# EAGLE schematic cookie-mouse (EAGLE 6.6.0)
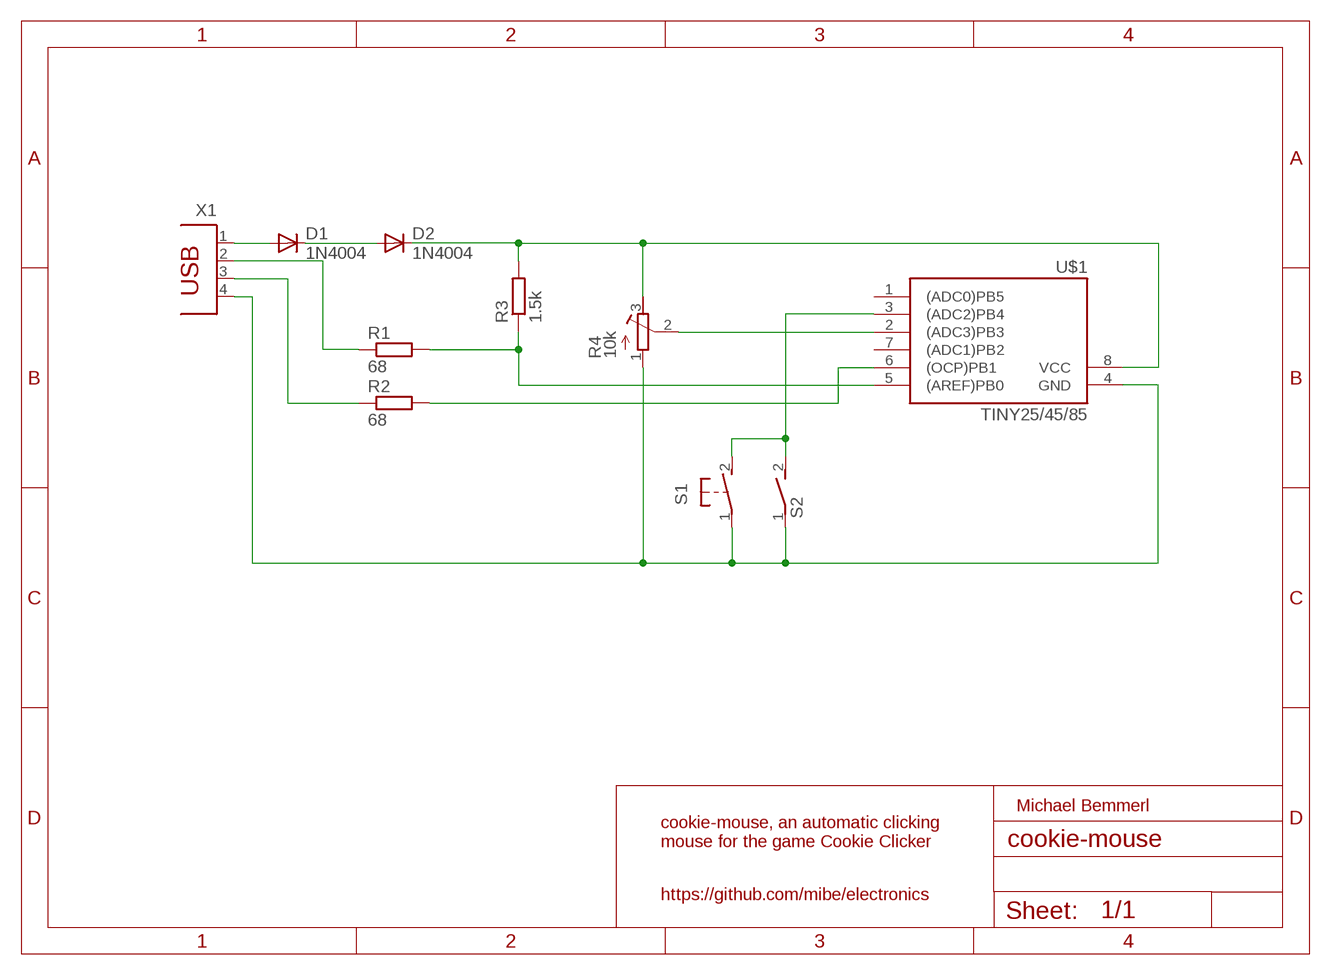
[diagram p0: schematic, sheet 1]

## Parts
D1  1N4004  [DO41-10]
D2  1N4004  [DO41-10]
R1  68  R-EU_0207/10  [0207/10]
R2  68  R-EU_0207/10  [0207/10]
R3  1.5k  R-EU_0207/10  [0207/10]
R4  10k  R-TRIMM4G/J  [RTRIM4G/J]
S1  31-XX  [B3F-31XX]
S2  DS01E  [DS-01]
U$1  TINY25/45/85  [DIL08]
X1  PN61729  [PN61729]

## Nets
N$1: R1.1 X1.2
N$2: D1.A X1.1
N$3: D1.C D2.A
N$4: R2.1 X1.3
N$5: R1.2 R3.1 U$1.5((AREF)PB0)
N$6: D2.C R3.2 R4.3(A) U$1.8(VCC)
N$7: R2.2 U$1.6((OCP)PB1)
N$8: R4.2(S) U$1.2((ADC3)PB3)
N$9: R4.1(E) S1.1(P) S2.1 U$1.4(GND) X1.4
N$10: S1.2(S) S2.2 U$1.3((ADC2)PB4)
Unconnected: U$1.1((ADC0)PB5) U$1.7((ADC1)PB2)

## Notes on the sheet
- Michael Bemmerl
- cookie-mouse, an automatic clicking
  mouse for the game Cookie Clicker
- https://github.com/mibe/electronics

## Library data of the parts
D1 D2 = diode:1N4004: DIODE general purpose rectifier, 1 A
R1-R3 = resistor:R-EU_: RESISTOR, European symbol
R4 = resistor:R-TRIMM: Trimm resistor
S1 = switch-omron:31-XX: OMRON SWITCH; MPN: B3F-3100; OC_FARNELL: 959704; OC_NEWARK: 36M3582
S2 = switch-dil:DS01E: DIL/CODE SWITCH; OC_FARNELL: unknown; OC_NEWARK: unknown
U$1 = avr-7 ulli:TINY25/45/85
X1 = con-berg:PN61729: BERG USB connector; OC_FARNELL: unknown; OC_NEWARK: unknown